# Altium schematic sheet Connector.SchDoc
size A3; SheetNumber: 2; SheetTotal: 5
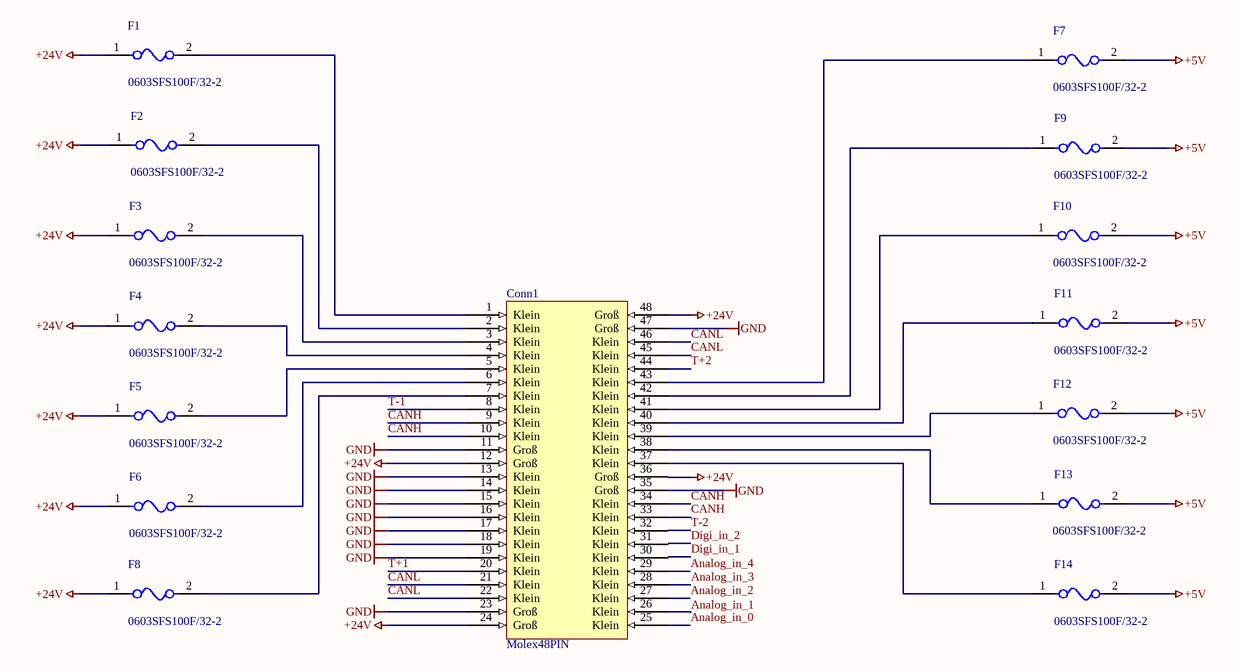
[diagram p0: Connector.SchDoc]

## Parts
Conn1  Molex48PIN  [PCBComponent_1]
F1  0603SFS100F/32-2  [FP-0603SFS-MFG]
F2  0603SFS100F/32-2  [FP-0603SFS-MFG]
F3  0603SFS100F/32-2  [FP-0603SFS-MFG]
F4  0603SFS100F/32-2  [FP-0603SFS-MFG]
F5  0603SFS100F/32-2  [FP-0603SFS-MFG]
F6  0603SFS100F/32-2  [FP-0603SFS-MFG]
F7  0603SFS100F/32-2  [FP-0603SFS-MFG]
F8  0603SFS100F/32-2  [FP-0603SFS-MFG]
F9  0603SFS100F/32-2  [FP-0603SFS-MFG]
F10  0603SFS100F/32-2  [FP-0603SFS-MFG]
F11  0603SFS100F/32-2  [FP-0603SFS-MFG]
F12  0603SFS100F/32-2  [FP-0603SFS-MFG]
F13  0603SFS100F/32-2  [FP-0603SFS-MFG]
F14  0603SFS100F/32-2  [FP-0603SFS-MFG]

## Nets
+5V: F7.2 F9.2 F10.2 F11.2 F12.2 F13.2 F14.2
+24V: Conn1.12(Groß) Conn1.24(Groß) Conn1.36(Groß) Conn1.48(Groß) F1.1 F2.1 F3.1 F4.1 F5.1 F6.1 F8.1
GND: Conn1.11(Groß) Conn1.13(Klein) Conn1.14(Klein) Conn1.15(Klein) Conn1.16(Klein) Conn1.17(Klein) Conn1.18(Klein) Conn1.19(Klein) Conn1.23(Groß) Conn1.35(Groß) Conn1.47(Groß)
Analog_in_0: Conn1.25(Klein)
Analog_in_1: Conn1.26(Klein)
Analog_in_2: Conn1.27(Klein)
Analog_in_3: Conn1.28(Klein)
Analog_in_4: Conn1.29(Klein)
CANH: Conn1.9(Klein) Conn1.10(Klein) Conn1.33(Klein) Conn1.34(Klein)
CANL: Conn1.21(Klein) Conn1.22(Klein) Conn1.45(Klein) Conn1.46(Klein)
T+1: Conn1.20(Klein)
T+2: Conn1.44(Klein)
T-1: Conn1.8(Klein)
T-2: Conn1.32(Klein)
NetConn1_1: Conn1.1(Klein) F1.2
NetConn1_2: Conn1.2(Klein) F2.2
NetConn1_3: Conn1.3(Klein) F3.2
NetConn1_4: Conn1.4(Klein) F4.2
NetConn1_5: Conn1.5(Klein) F5.2
NetConn1_6: Conn1.6(Klein) F6.2
NetConn1_7: Conn1.7(Klein) F8.2
NetConn1_37: Conn1.37(Klein) F14.1
NetConn1_38: Conn1.38(Klein) F13.1
NetConn1_39: Conn1.39(Klein) F12.1
NetConn1_40: Conn1.40(Klein) F11.1
NetConn1_41: Conn1.41(Klein) F10.1
NetConn1_42: Conn1.42(Klein) F9.1
NetConn1_43: Conn1.43(Klein) F7.1

Not connected (* = marked no-connect by the designer): Conn1 30(Klein) 31(Klein)

## Library data of the parts
F1-F14 = CMP-08605-000034-1: 0438003.WRGT; Manufacturer: Littelfuse; Resistance: 0.2Ω; Fuse Interrupt Dc Current: 50A; Max Fuse Dc Voltage: 32V; Fuse Current: 1A; Fuse I2T: 0.093A2Sec; Fuse Blow Speed: Slow; Value: 0.2Ω; Device Class L1: Circuit Protection; Device Class L3: unset; Category: Fuse; Temperature Range High: +125°C; ComponentLink2Description: Datasheet; Automotive: No; Device Class L2: Fuses; Lead Free: Yes; Temperature: -55°C to +125°C; Digikey Description: FUSE BOARD MOUNT 1A 32VDC 0603; ComponentLink2URL: https://www.littelfuse.com/~/media/electronics/datasheets/fuses/littelfuse_fuse_sfs_datasheet.pdf.pdf; Octopart: https://octopart.com/0603sfs100f%2F32-2-littelfuse-74214378; Voltage Rating: 32V; RoHS: TRUE; Manufacturer Part Number: 0603SFS100F/32-2; Package: 0603SFS; Height: 0.95mm; Ipc Land Pattern Name: CAPC16080X80; Temperature Range Low: -55°C